# EAGLE schematic B PCB1 (EAGLE 9.1.0)

## Sheet 1 of 4
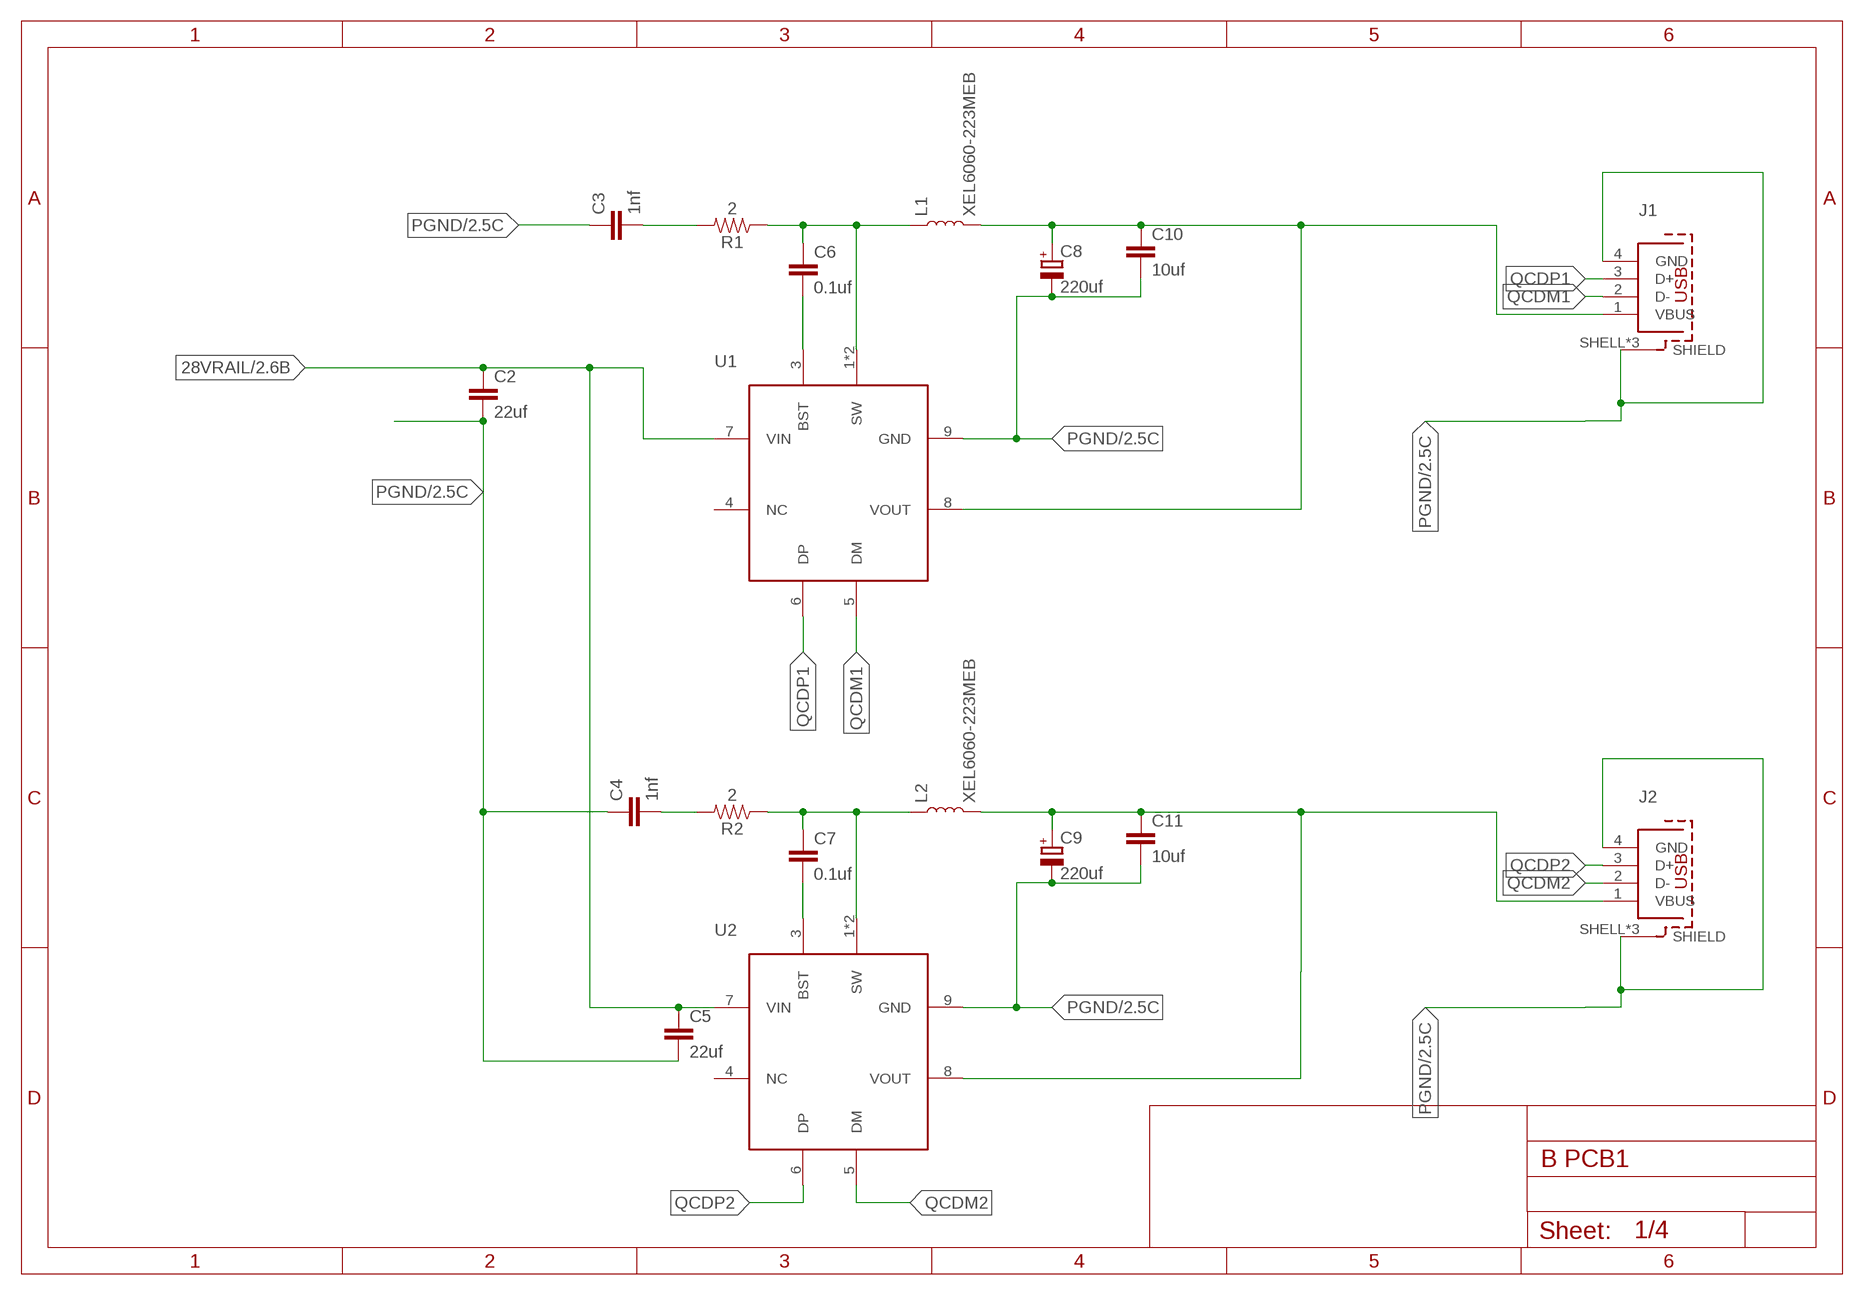
[diagram p0: schematic, sheet 1]

### Parts
C2  22uf  C-EUC0805K  [C0805K]
C3  1nf  C-EUC0402K  [C0402K]
C4  1nf  C-EUC0402K  [C0402K]
C5  22uf  C-EUC0805K  [C0805K]
C6  0.1uf  C-EUC0805K  [C0805K]
C7  0.1uf  C-EUC0805K  [C0805K]
C8  220uf  EMZR250ARA221MF80G  [CAPAE660X800]
C9  220uf  EMZR250ARA221MF80G  [CAPAE660X800]
C10  10uf  C-EUC0805K  [C0805K]
C11  10uf  C-EUC0805K  [C0805K]
J1  614004184726  [614004184726]
J2  614004184726  [614004184726]
L1  XEL6060-223MEB  XEL6060-222MEB  [RESM6365X610]
L2  XEL6060-223MEB  XEL6060-222MEB  [RESM6365X610]
R1  2  RES4K04020402  [0402]
R2  2  RES4K04020402  [0402]
U1  IP6505  [SOIC127P600X165-9T209]
U2  IP6505  [SOIC127P600X165-9T209]

### Nets
28VRAIL: C2.1 C5.1 U1.7(VIN) U2.7(VIN) ; also sheet 2,3
N$1: C7.1 L2.1 R2.1 U2.1(SW) U2.2(SW)
N$2: C7.2 U2.3(BST)
N$4: C6.1 L1.1 R1.1 U1.1(SW) U1.2(SW)
N$5: C9.1(+) C11.1 J2.1(VBUS) L2.2 U2.8(VOUT)
N$6: C4.2 R2.2
N$7: C6.2 U1.3(BST)
N$8: C3.2 R1.2
N$11: C8.1(+) C10.1 J1.1(VBUS) L1.2 U1.8(VOUT)
PGND: C2.2 C3.1 C4.1 C5.2 C8.2(-) C9.2(-) C10.2 C11.2 J1.4(GND) J1.SHELL1(SHIELD) J1.SHELL2(SHIELD) J1.SHELL(SHIELD) J2.4(GND) J2.SHELL1(SHIELD) J2.SHELL2(SHIELD) J2.SHELL(SHIELD) U1.9(GND) U2.9(GND) ; also sheet 2,3,4
QCDM1: J1.2(D-) U1.5(DM)
QCDM2: J2.2(D-) U2.5(DM)
QCDP1: J1.3(D+) U1.6(DP)
QCDP2: J2.3(D+) U2.6(DP)
Unconnected: U1.4(NC) U2.4(NC)

## Sheet 2 of 4
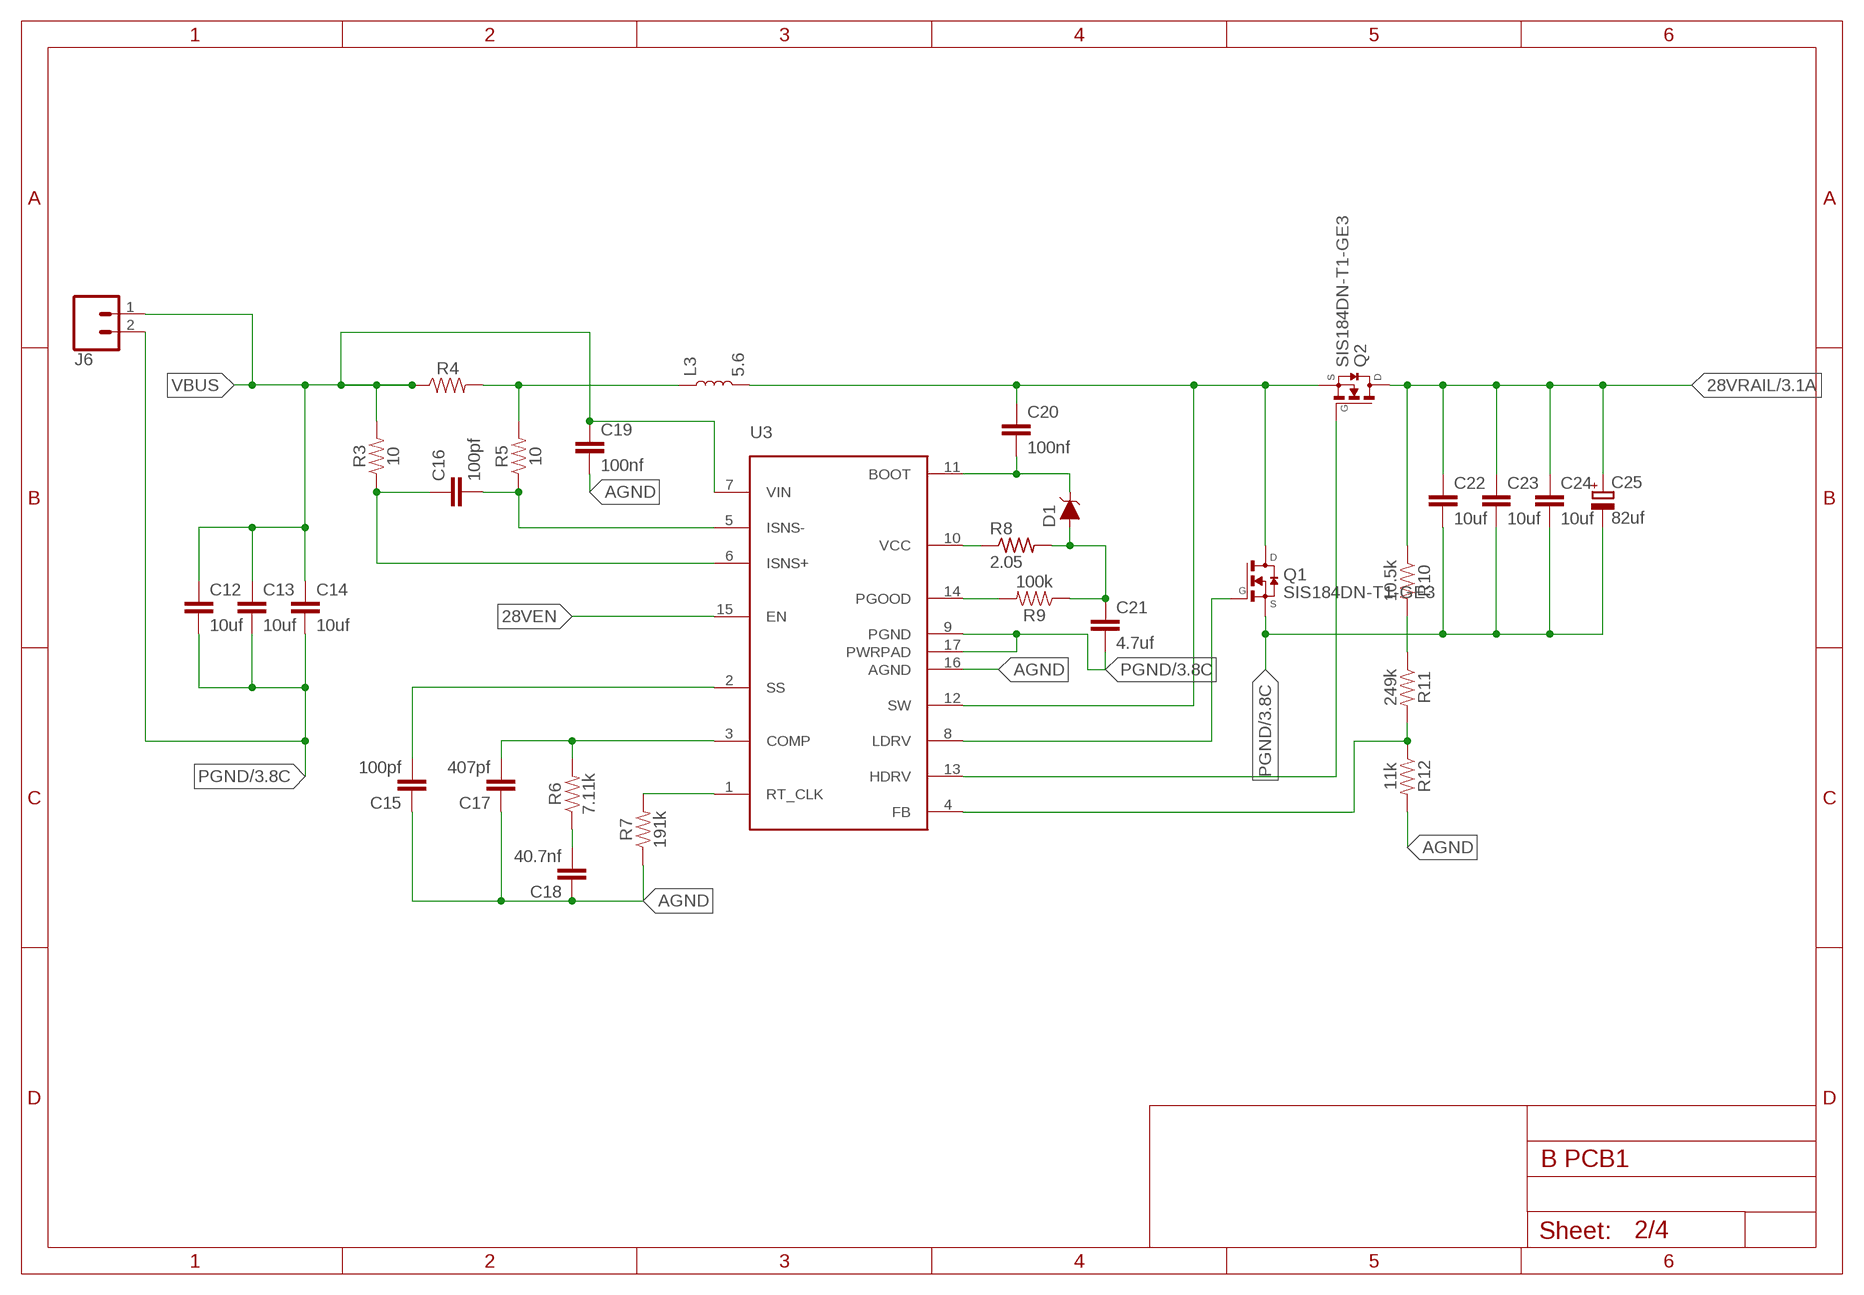
[diagram p1: schematic, sheet 2]

### Parts
C12  10uf  C-EUC0805K  [C0805K]
C13  10uf  C-EUC0805K  [C0805K]
C14  10uf  C-EUC0805K  [C0805K]
C15  100pf  C-EUC0402K  [C0402K]
C16  100pf  C-EUC0402K  [C0402K]
C17  407pf  C-EUC0402K  [C0402K]
C18  40.7nf  C-EUC0402K  [C0402K]
C19  100nf  C-EUC0402K  [C0402K]
C20  100nf  C-EUC0402K  [C0402K]
C21  4.7uf  C-EUC0402K  [C0402K]
C22  10uf  C-EUC1206K  [C1206K]
C23  10uf  C-EUC1206K  [C1206K]
C24  10uf  C-EUC1206K  [C1206K]
C25  82uf  EMZR250ARA221MF80G  [CAPAE660X800]
D1  SS24FL  [SODFL3617X108]
J6  CONN_021.4HOLE  [1X02_1.4HOLE]
L3  5.6  XAL7070-472MEB  [RESM7275X700]
Q1  SIS184DN-T1-GE3  [SIS184DN-T1-GE3]
Q2  SIS184DN-T1-GE3  [SIS184DN-T1-GE3]
R3  10  RES4K04020402  [0402]
R4  LRMAM2512-R0035FT4  [RESC6432X90]
R5  10  RES4K04020402  [0402]
R6  7.11k  RES4K04020402  [0402]
R7  191k  RES4K04020402  [0402]
R8  2.05  R-US_R0603  [R0603]
R9  100k  RES4K04020402  [0402]
R10  10.5k  RES4K04020402  [0402]
R11  249k  RES4K04020402  [0402]
R12  11k  RES4K04020402  [0402]
U3  TPS43061  [QFN50P300X300X100-17T80X120]

### Nets
28VEN: U3.15(EN)
28VRAIL: C22.1 C23.1 C24.1 C25.1(+) Q2.P$5(D) Q2.P$6(D) Q2.P$7(D) Q2.P$8(D) Q2.P$9(D) R10.1 ; also sheet 1,3
AGND: C15.1 C17.1 C18.1 C19.2 R7.1 R12.2 U3.16(AGND)
N$21: C20.1 L3.2 Q1.P$5(D) Q1.P$6(D) Q1.P$7(D) Q1.P$8(D) Q1.P$9(D) Q2.P$1(S) Q2.P$2(S) Q2.P$3(S) U3.12(SW)
N$22: R10.2 R11.1
N$23: L3.1 R4.2 R5.2
N$24: C16.1 R3.1 U3.6(ISNS+)
N$26: C16.2 R5.1 U3.5(ISNS-)
N$27: C20.2 D1.1(C) U3.11(BOOT)
N$28: C21.1 D1.2(A) R8.2 R9.1
N$29: R9.2 U3.14(PGOOD)
N$30: R8.1 U3.10(VCC)
N$31: R7.2 U3.1(RT_CLK)
N$32: Q2.P$4(G) U3.13(HDRV)
N$33: Q1.P$4(G) U3.8(LDRV)
N$34: R11.2 R12.1 U3.4(FB)
N$35: C17.2 R6.2 U3.3(COMP)
N$36: C18.2 R6.1
N$38: C15.2 U3.2(SS)
PGND: C12.2 C13.2 C14.2 C21.2 C22.2 C23.2 C24.2 C25.2(-) J6.2 Q1.P$1(S) Q1.P$2(S) Q1.P$3(S) U3.9(PGND) U3.17(PWRPAD) ; also sheet 1,3,4
VBUS: C12.1 C13.1 C14.1 C19.1 J6.1 R3.2 R4.1 U3.7(VIN)

## Sheet 3 of 4
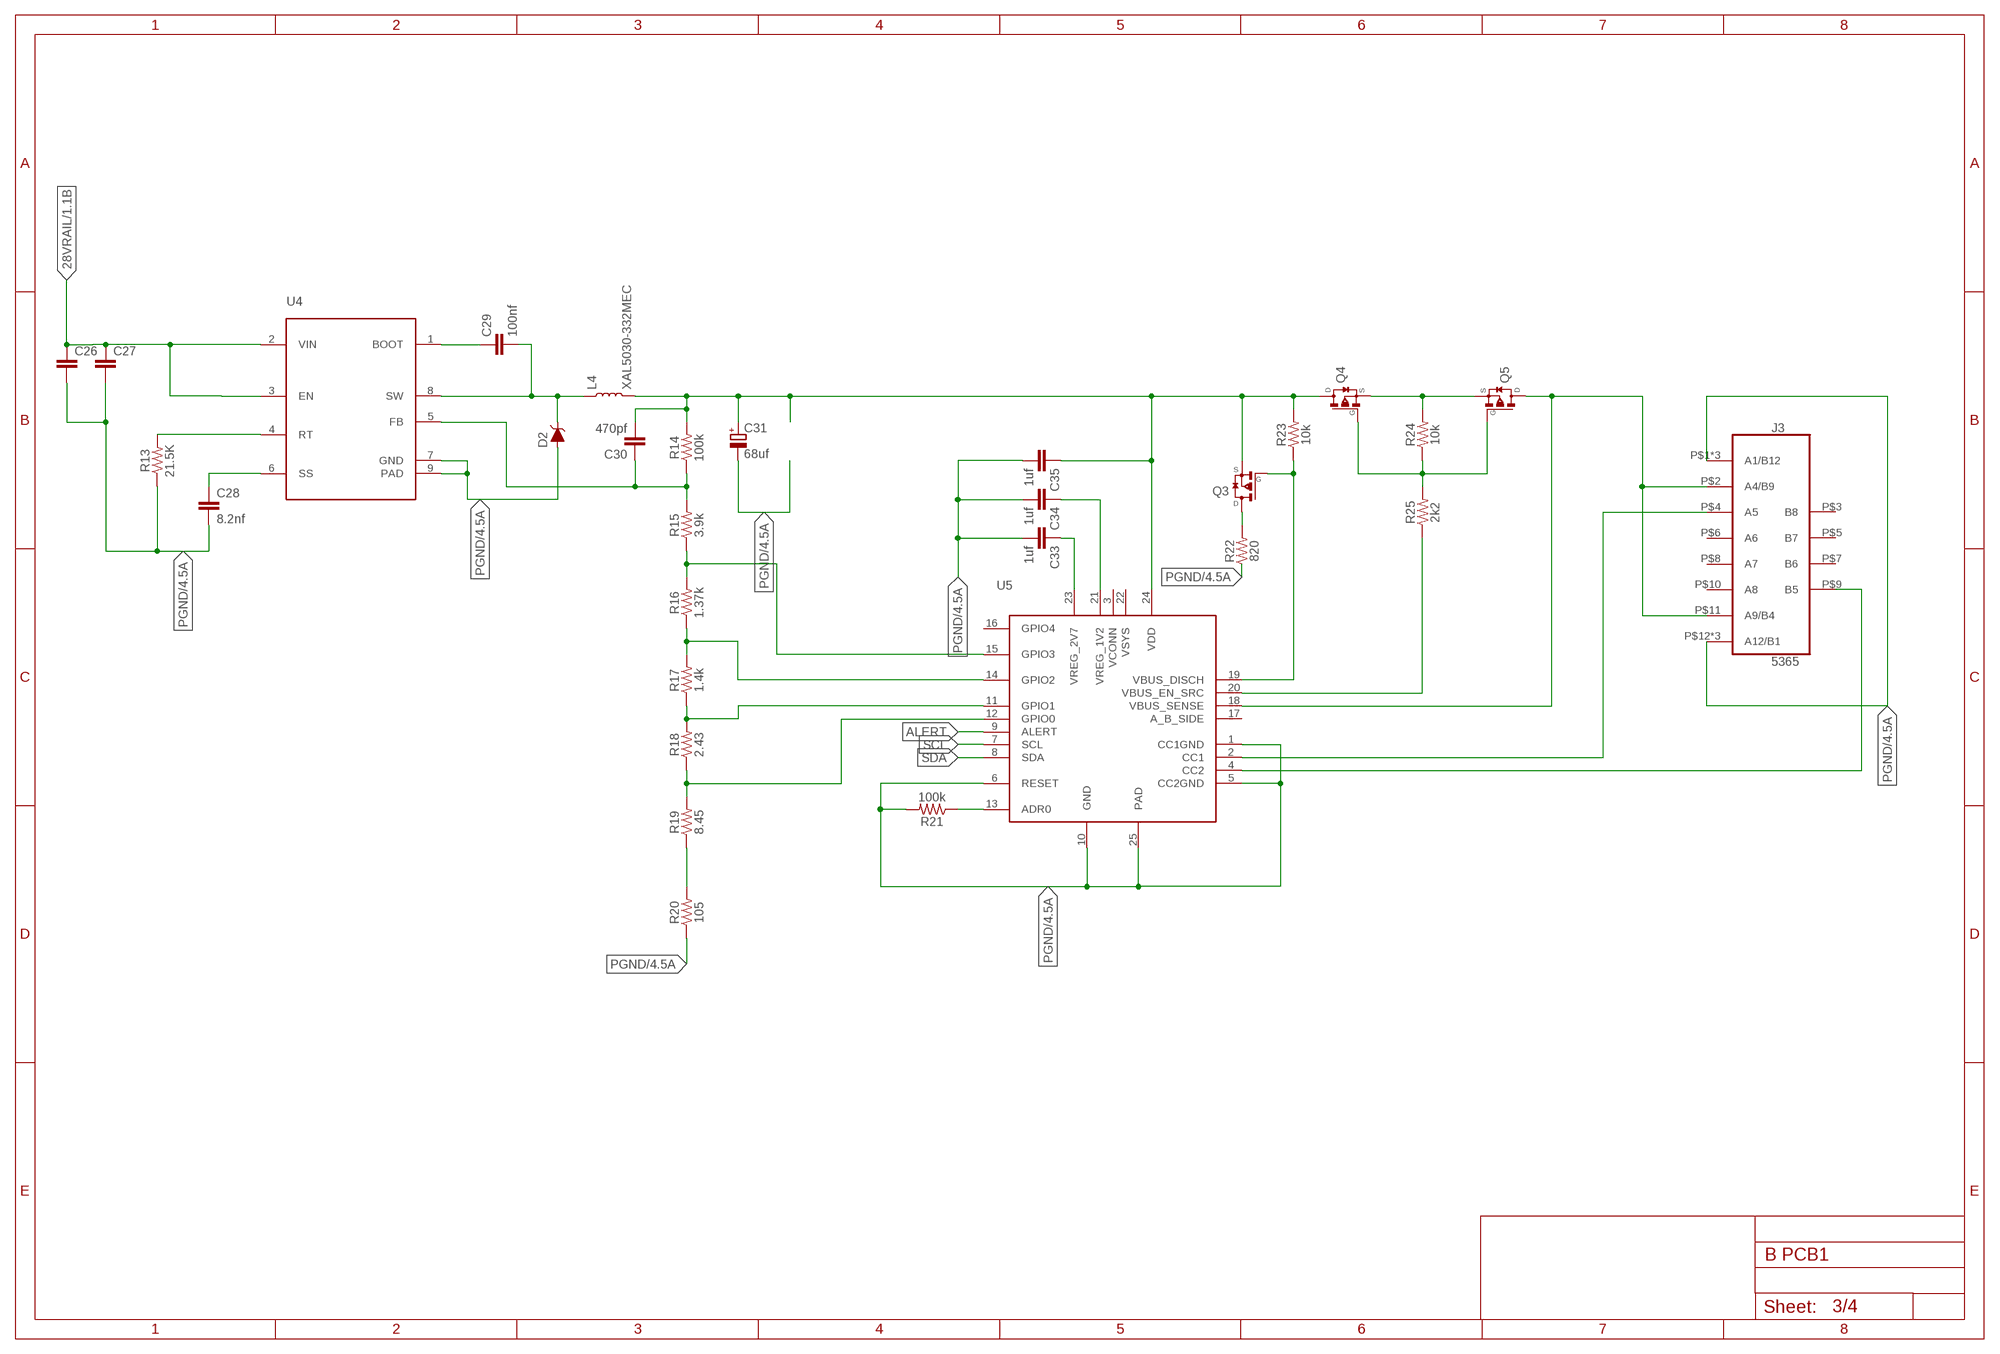
[diagram p2: schematic, sheet 3]

### Parts
C26  C-EUC1210  [C1210]
C27  C-EUC1210  [C1210]
C28  8.2nf  C-EUC0402K  [C0402K]
C29  100nf  C-EUC0402K  [C0402K]
C30  470pf  C-EUC0402K  [C0402K]
C31  68uf  PCR1H820MCL6GS  [CAPAE830X1040]
C33  1uf  C-EUC0402K  [C0402K]
C34  1uf  C-EUC0402K  [C0402K]
C35  1uf  C-EUC0402K  [C0402K]
D2  B560C-13-F  [DIOM6859X250]
J3  5365  [5365]
L4  XAL5030-332MEC  [INDM5355X310]
Q3  STR2P3LLH6  [SOT95P280X125-3]
Q4  STL9P3LLH6  [SON65P330X330X80-8]
Q5  STL9P3LLH6  [SON65P330X330X80-8]
R13  21.5K  RES4K04020402  [0402]
R14  100k  RES4K04020402  [0402]
R15  3.9k  RES4K04020402  [0402]
R16  1.37k  RES4K04020402  [0402]
R17  1.4k  RES4K04020402  [0402]
R18  2.43  RES4K04020402  [0402]
R19  8.45  RES4K04020402  [0402]
R20  105  RES4K04020402  [0402]
R21  100k  RES4K04020402  [0402]
R22  820  RES4K04020402  [0402]
R23  10k  RES4K04020402  [0402]
R24  10k  RES4K04020402  [0402]
R25  2k2  RES4K04020402  [0402]
U4  LMR14050  [SOIC127P600X170-9T240X260]
U5  STUSB4700  [QFN50P400X400X100-25T270]

### Nets
28VRAIL: C26.1 C27.1 U4.2(VIN) U4.3(EN) ; also sheet 1,2
ALERT: U5.9(ALERT)
N$10: C33.1 U5.23(VREG_2V7)
N$12: C34.1 U5.21(VREG_1V2)
N$13: Q3.3(D) R22.2
N$14: C30.1 R14.1 R15.2 U4.5(FB)
N$15: R15.1 R16.2 U5.15(GPIO3)
N$16: R16.1 R17.2 U5.14(GPIO2)
N$17: R17.1 R18.2 U5.11(GPIO1)
N$18: R18.1 R19.2 U5.12(GPIO0)
N$19: R19.1 R20.2
N$20: R21.1 U5.13(ADR0)
N$25: C29.1 U4.1(BOOT)
N$37: C29.2 D2.1(C) L4.1 U4.8(SW)
N$39: C28.1 U4.6(SS)
N$40: Q4.1(S) Q4.2(S) Q4.3(S) Q5.1(S) Q5.2(S) Q5.3(S) R24.2
N$41: R13.2 U4.4(RT)
N$42: C30.2 C31.1(+) C35.1 L4.2 Q3.2(S) Q4.5(D) Q4.6(D) Q4.7(D) R14.2 R23.2 U5.24(VDD)
N$43: Q3.1(G) R23.1 U5.19(VBUS_DISCH)
N$44: Q4.4(G) Q5.4(G) R24.1 R25.2
N$45: R25.1 U5.20(VBUS_EN_SRC)
N$46: J3.P$2(A4/B9) J3.P$11(A9/B4) Q5.5(D) Q5.6(D) Q5.7(D) U5.18(VBUS_SENSE)
N$48: J3.P$4(A5) U5.2(CC1)
N$49: J3.P$9(B5) U5.4(CC2)
PGND: C26.2 C27.2 C28.2 C31.2(-) C33.2 C34.2 C35.2 D2.2(A) J3.P$1(A1/B12) J3.P$12(A12/B1) J3.P$13(A1/B12) J3.P$14(A12/B1) J3.P$15(A1/B12) J3.P$16(A12/B1) R13.1 R20.1 R21.2 R22.1 U4.7(GND) U4.9(PAD) U5.1(CC1GND) U5.5(CC2GND) U5.6(RESET) U5.10(GND) U5.25(PAD) ; also sheet 1,2,4
SCL: U5.7(SCL)
SDA: U5.8(SDA)
Unconnected: J3.P$3(B8) J3.P$5(B7) J3.P$6(A6) J3.P$7(B6) J3.P$8(A7) J3.P$10(A8) U5.3(VCONN) U5.16(GPIO4) U5.17(A_B_SIDE) U5.22(VSYS)

## Sheet 4 of 4
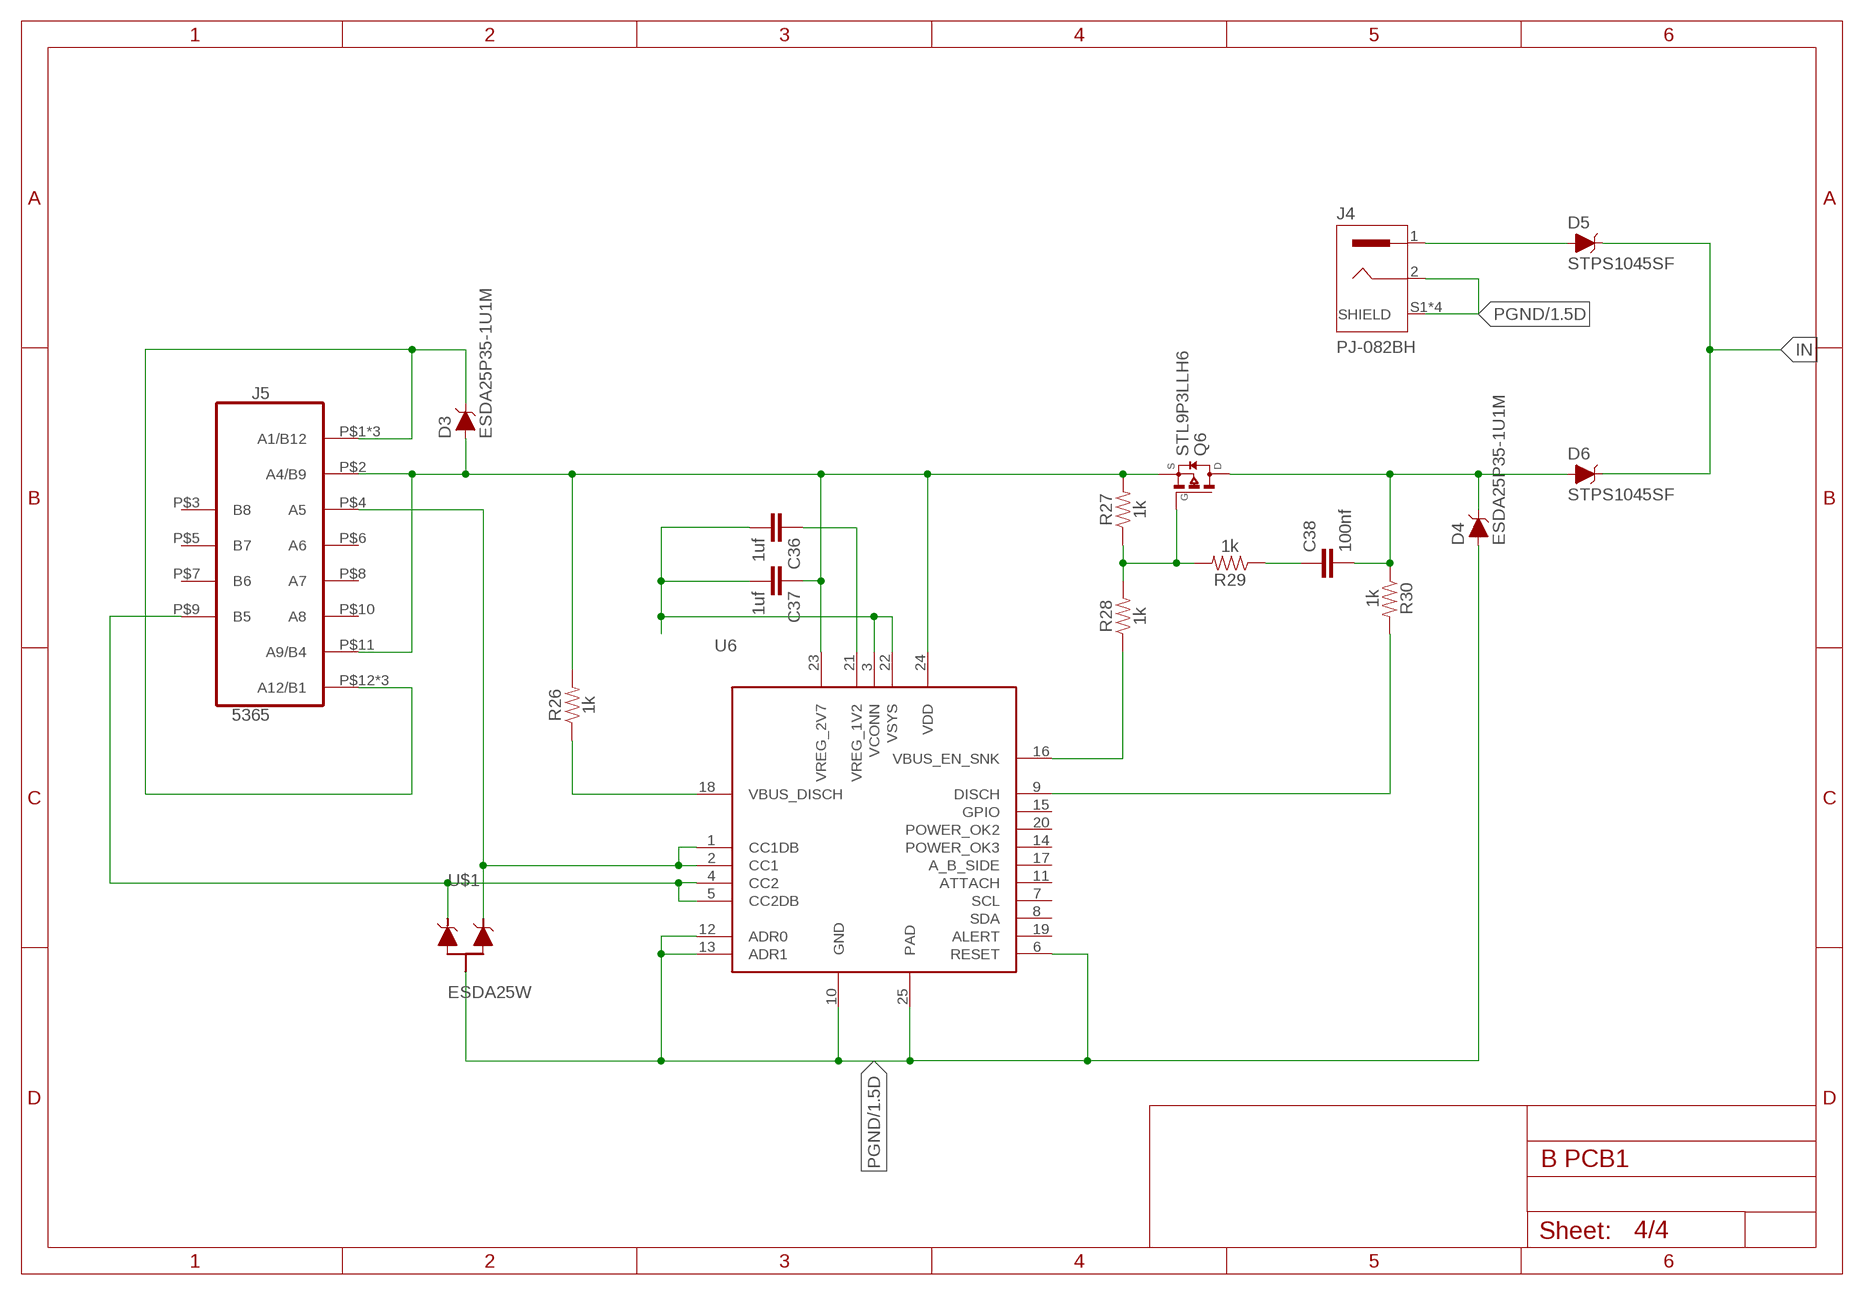
[diagram p3: schematic, sheet 4]

### Parts
C36  1uf  C-EUC0402K  [C0402K]
C37  1uf  C-EUC0402K  [C0402K]
C38  100nf  C-EUC0402K  [C0402K]
D3  ESDA25P35-1U1M  [DIODFN160X100X60-2]
D4  ESDA25P35-1U1M  [DIODFN160X100X60-2]
D5  STPS1045SF  [DIODFN650X460X120-3]
D6  STPS1045SF  [DIODFN650X460X120-3]
J4  PJ-082BH  [CUI_PJ-082BH]
J5  5365  [5365]
Q6  STL9P3LLH6  [SON65P330X330X80-8]
R26  1k  RES4K04020402  [0402]
R27  1k  RES4K04020402  [0402]
R28  1k  RES4K04020402  [0402]
R29  1k  RES4K04020402  [0402]
R30  1k  RES4K04020402  [0402]
U6  STUSB4500  [QFN50P400X400X100-25T270]
U$1  ESDA25W  [SOT65P210X110-3]

### Nets
IN: D5.3(C) D6.3(C)
N$47: D5.1(A) D5.2(A) J4.1
N$50: D3.1(C) J5.P$1(A1/B12) J5.P$12(A12/B1) J5.P$13(A1/B12) J5.P$14(A12/B1) J5.P$15(A1/B12) J5.P$16(A12/B1)
N$51: J5.P$4(A5) U6.1(CC1DB) U6.2(CC1) U$1.2(C2)
N$52: J5.P$9(B5) U6.4(CC2) U6.5(CC2DB) U$1.1(C1)
N$53: R26.1 U6.18(VBUS_DISCH)
N$54: C36.1 U6.21(VREG_1V2)
N$55: C36.2 C37.2 U6.3(VCONN) U6.22(VSYS)
N$56: C37.1 D3.2(A) J5.P$2(A4/B9) J5.P$11(A9/B4) Q6.1(S) Q6.2(S) Q6.3(S) R26.2 R27.2 U6.23(VREG_2V7) U6.24(VDD)
N$57: Q6.4(G) R27.1 R28.2 R29.2
N$58: R28.1 U6.16(VBUS_EN_SNK)
N$59: R30.2 U6.9(DISCH)
N$60: C38.1 R29.1
N$61: C38.2 D4.1(C) D6.1(A) D6.2(A) Q6.5(D) Q6.6(D) Q6.7(D) R30.1
PGND: D4.2(A) J4.2 J4.S1(SHIELD) J4.S2(SHIELD) J4.S3(SHIELD) J4.S4(SHIELD) U6.6(RESET) U6.10(GND) U6.12(ADR0) U6.13(ADR1) U6.25(PAD) U$1.3(A) ; also sheet 1,2,3
Unconnected: J5.P$3(B8) J5.P$5(B7) J5.P$6(A6) J5.P$7(B6) J5.P$8(A7) J5.P$10(A8) U6.7(SCL) U6.8(SDA) U6.11(ATTACH) U6.14(POWER_OK3) U6.15(GPIO) U6.17(A_B_SIDE) U6.19(ALERT) U6.20(POWER_OK2)

## Library data of the parts
C2-C7 C10-C24 C26-C30 C33-C38 = rcl:C-EU: CAPACITOR, European symbol; SPICEPREFIX: C
C8 C9 C25 = BMS:EMZR250ARA221MF80G
C31 = BMS:PCR1H820MCL6GS
D1 = BMS:SS24FL
D2 = BMS:B560C-13-F
D3 D4 = BMS:ESDA25P35-1U1M
D5 D6 = BMS:STPS1045SF
J1 J2 = CSD25402Q3A:614004184726: USB TYPE A UP RIGHT THT - SHORT TYPE =>ConUSB2 614004184726 Characteristics INSULATOR:PBT FLAMMABILITY RATING: UL94-V0 COLOR: WHITE CONTACT MATERIAL: COPPER ALLOY CONTACT PLATING: GOLD OVER TIN COVER MATERIAL: BRASS COVER PLATING: Ni QUALITY CLASS: 5 000 MATING CYCLES OPERATING TEMPERATURE:-40°C UP TO +85°C COMPLIANCE: LEAD FREE AND ROHS ELECTRICAL CURRENT RATING: 2A WORKING VOLTAGE: 30VAC WITHSTANDING VOLTAGE: 500 VAC/MIN INSULATION RESISTANCE: > 1000 MΩ CONTACT RESISTANCE: 30 mΩ MAX <http://katalog.we-online.de/media/images/v2/Family_WR-COM_614004184726_4C.jpg> Details see: http://katalog.we-online.de/en/em/COM_THT_TYPE_A_UP_RIGHT/614004184726 2015 (C) Wurth Elektronik
J3 J5 = CSD25402Q3A:5365
J4 = PJ-082BH:PJ-082BH: 2.5 mm Center Pin, 10 A, Right Angle, Through Hole, Shielded, Dc Power Jack Connector; AVAILABILITY: Bad; MANUFACTURER: CUI Inc.; MP: PJ-082BH; PACKAGE: None; PARTREV: 1.02; PRICE: 1.25 USD; STANDARD: Manufacturer Recommendation
J6 = SparkFun-Connectors:CONN_02: Multi connection point. Often used as Generic Header-pin footprint for 0.1 inch spaced/style header connections On any of the 0.1 inch spaced packages, you can populate with these: Break Away Headers - Straight <https://www.sparkfun.com/products/116> (PRT-00116) Break Away Male Headers - Right Angle <https://www.sparkfun.com/products/553> (PRT-00553) Female Headers <https://www.sparkfun.com/products/115> (PRT-00115) Break Away Headers - Machine Pin <https://www.sparkfun.com/products/117> (PRT-00117) Break Away Female Headers - Swiss Machine Pin <https://www.sparkfun.com/products/743> (PRT-00743) For SCREWTERMINALS and SPRING TERMINALS visit here: Screw Terimnals on SparkFun.com <https://www.sparkfun.com/search/results?term=Screw+Terminals> (5mm/3.5mm/2.54mm spacing) This device is also useful as a general connection point to wire up your design to another part of your project. Our various solder wires solder well into these plated through hole pads. Hook-Up Wire - Assortment (Stranded, 22 AWG) <https://www.sparkfun.com/products/11375> (PRT-11375) Hook-Up Wire - Assortment (Solid Core, 22 AWG) <https://www.sparkfun.com/products/11367> (PRT-11367) View the entire wire category on our website here <https://www.sparkfun.com/categories/141> Special notes: Molex polarized connector foot print use with: PRT-08233 with associated crimp pins and housings. 2.54_SCREWTERM for use with PRT-10571. 3.5mm Screw Terminal footprints for PRT-08084 5mm Screw Terminal footprints for use with PRT-08432
L1 L2 = BMS:XEL6060-222MEB
L3 = BMS:XAL7070-472MEB
L4 = BMS:XAL5030-332MEC
Q1 Q2 = CSD25402Q3A:SIS184DN-T1-GE3
Q3 = BMS:STR2P3LLH6
Q4-Q6 = BMS:STL9P3LLH6
R1-R3 R5-R7 R9-R20 R22-R30 = BMS:RES4K0402
R4 = BMS:LRMAM2512-R0035FT4
R8 = rcl:R-US_: RESISTOR, American symbol; SPICEPREFIX: R
R21 = BMS:RES4K0402; SPICEPREFIX: R
U1 U2 = BMS:IP6505
U3 = BMS:TPS43061
U4 = BMS:LMR14050
U5 = BMS:STUSB4700
U6 = BMS:STUSB4500
U$1 = BMS:ESDA25W